# EAGLE board KAC12040_sfe_v0.3 (EAGLE 6.5.2)
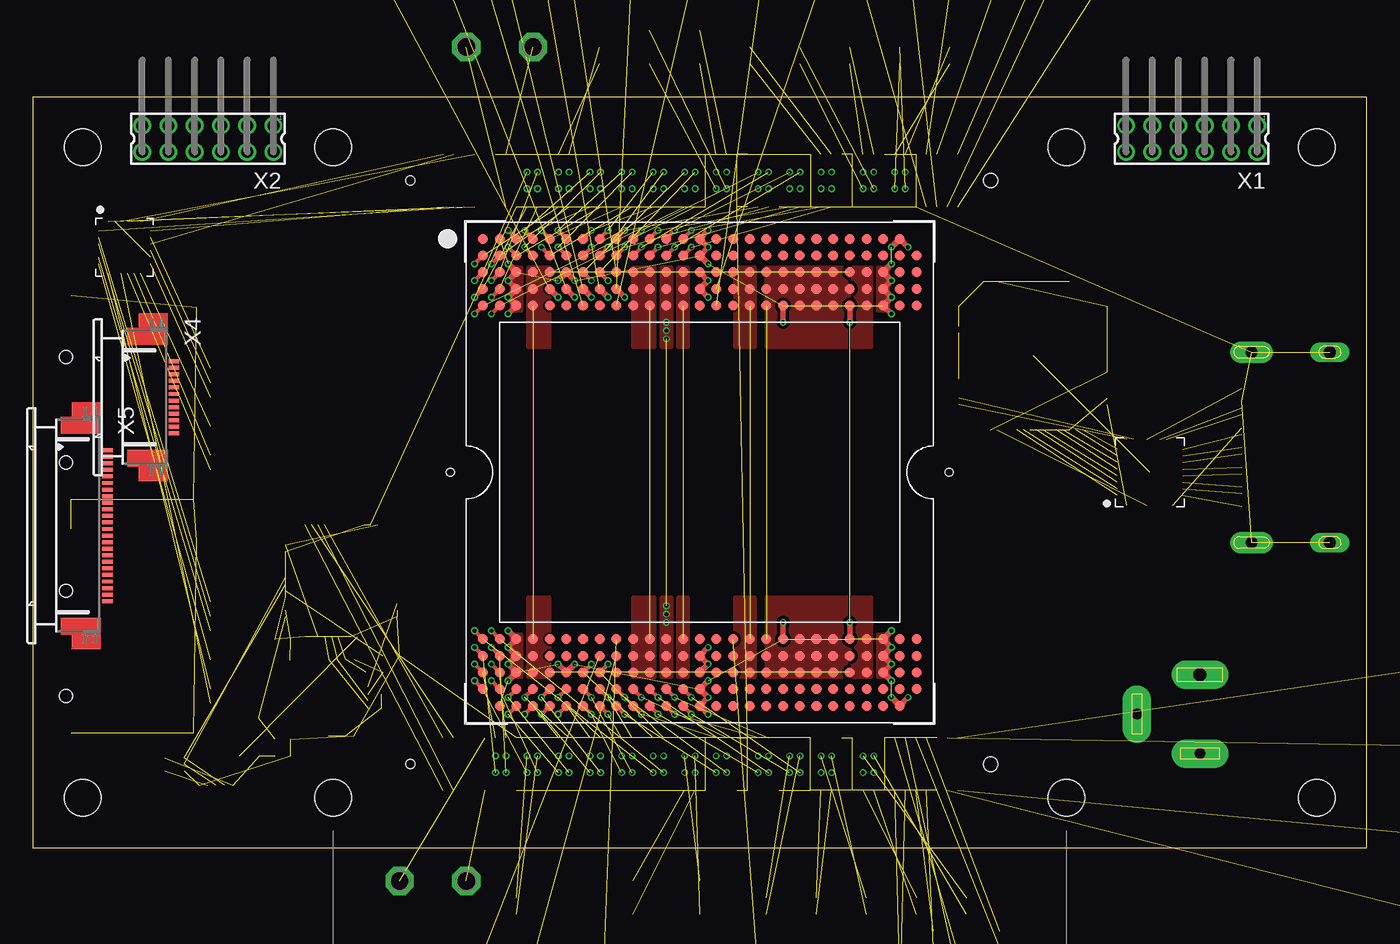
[diagram p6: board, top side]
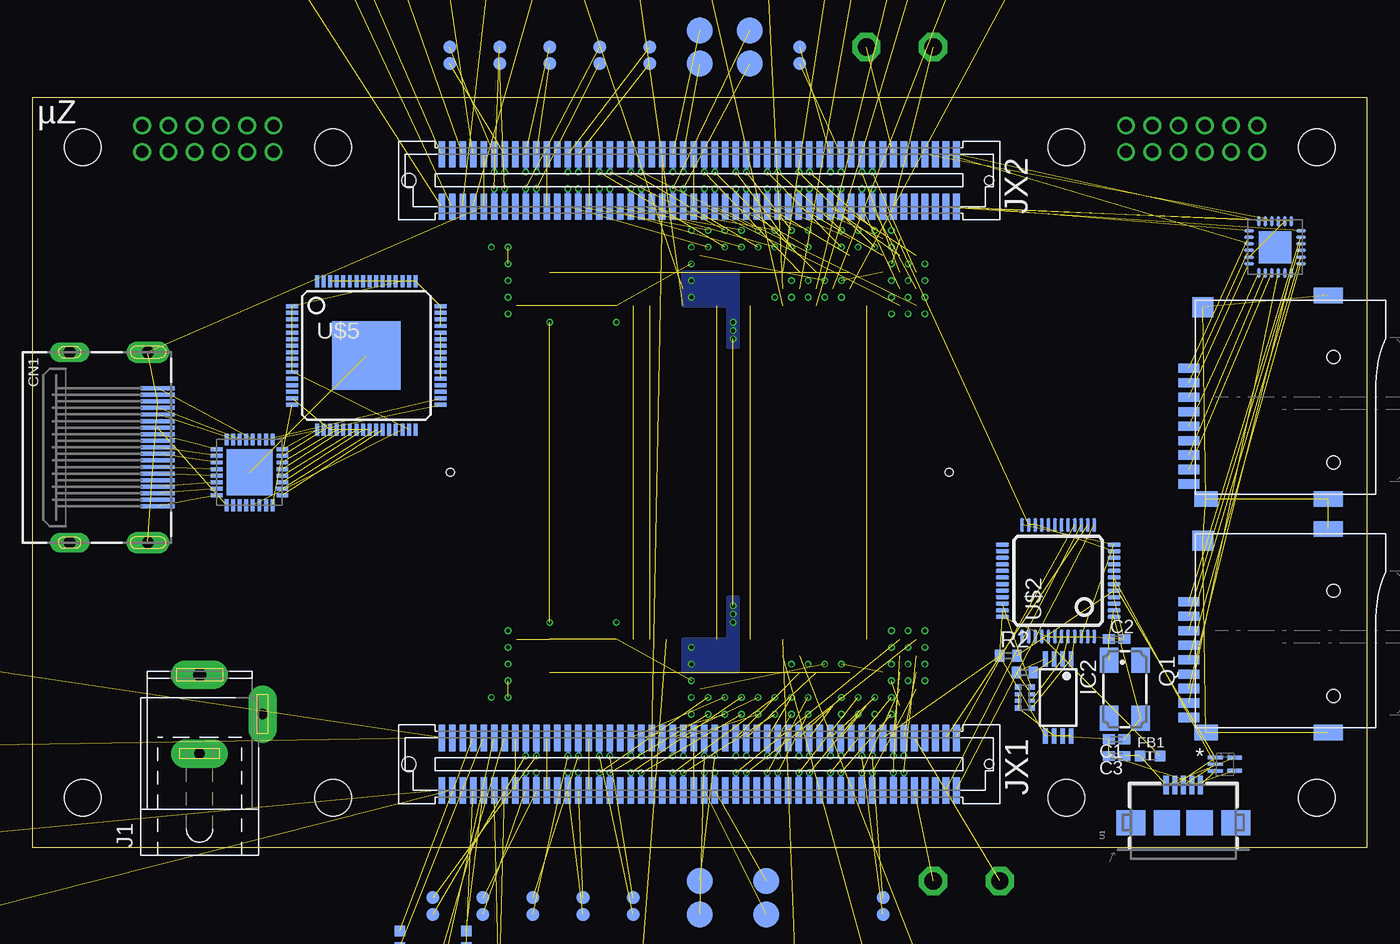
[diagram p7: board, bottom side, seen from below]

Size 101.6 x 57.15 mm. Coordinates in mm from the lower left corner, seen from the top.
Outline: 0,0 101.6,0 101.6,57.15 0,57.15 0,0
Copper layers (1+2*15+16): Top 0.035559375mm / dielectric 0.17018125mm / Route2 0.01778125mm / dielectric 47mil / Route15 0.0356mm / dielectric 0.2007mm / Bottom 0.0356mm
Design rules "LaenPCBOrder4L *": minimum track width 5mil, minimum drill 10mil, track to track 5mil, track to pad 5mil, pad to pad 5mil, via to via 5mil, smd to smd 5mil, copper to edge 15mil, drill to drill 5mil, minimum pad ring 4mil, minimum via ring 4mil, stop-mask expansion 4mil, vias tented up to drill 15mil, thermal gap 8mil
Net classes: 1 LVDS: width 0.305 mm, drill 0.305 mm, clearance 0.152 mm
Holes 2.8 mm at 22.86,3.81 78.74,3.81 78.74,53.34 22.86,53.34
tKeepout: area 1.3,1.3 to 6.3,6.3; area 1.3,50.8 to 6.3,55.8; area 95.3,50.8 to 100.3,55.8; area 95.3,1.3 to 100.3,6.3
bKeepout: area 20.4,1.3 to 25.4,6.3; area 20.4,50.8 to 25.4,55.8; area 76.2,50.8 to 81.2,55.8; area 76.2,1.3 to 81.2,6.3

## Footprints (pad centres in the part's own frame; a part is rotated, then mirrored left to right if it is on the bottom)
C0402K = smd 0.925 x 0.74: 1 -0.6,0; 2 0.6,0
HDMI_MOLEX_47151-0001 = smd 0.3 x 2.6: 1 4.5,0; 2 4,0; 3 3.5,0; 4 3,0; 5 2.5,0; 6 2,0; 7 1.5,0; 8 1,0; 9 0.5,0; 10 0,0; 11 -0.5,0; 12 -1,0; 13 -1.5,0; 14 -2,0; 15 -2.5,0; 16 -3,0; 17 -3.5,0; 18 -4,0; 19 -4.5,0 | drill 0.9 pad 1.65 long: P$1 -7.25,-0.76; P$2 7.25,-0.76 | drill 0.9 pad 1.5 long: P$3 7.25,-6.72; P$4 -7.25,-6.72
_0603MP = smd 0.8 x 0.8: 1 -0.762,0; 2 0.762,0
TSSOP8 = smd 0.35 x 1.2: 1 -0.975,-2.925; 2 -0.325,-2.925; 3 0.325,-2.925; 4 0.975,-2.925; 5 0.975,2.925; 6 0.325,2.925; 7 -0.325,2.925; 8 -0.975,2.925
SPC4077 = drill 0.8 pad 2.184 long: 1 -3,0; 2 0,-4.8 | drill 1 pad 2.184 long: 3 3,0
CTS406 = smd 1.9 x 1.4: 1 -2.2,-1.2; 2 2.2,-1.2; 3 2.2,1.2; 4 -2.2,1.2
R0402 = smd 0.7 x 0.9: 1 -0.65,0; 2 0.65,0
4X0402ARV341 = smd 0.4 x 0.5: 1 -0.8,-0.5; 4 0.8,-0.5; 5 0.8,0.5; 8 -0.8,0.5 | smd 0.3 x 0.5: 2 -0.25,-0.5; 3 0.25,-0.5; 6 0.25,0.5; 7 -0.25,0.5
TP10R = smd 1 x 1: TP 0,0
TP20R = smd 2 x 2: TP 0,0
P1-13 = drill 1.321 pad 2.159 octagon: TP 0,0
TP08SQ = smd 0.8 x 0.8: TP 0,0
TP18SQ = smd 1.8 x 1.8: TP 0,0
P1-13Y = drill 1.321 pad 1.905 long: TP 0,0
TP15SQ = smd 1.5 x 1.5: TP 0,0
TP15R = smd 1.5 x 1.5: TP 0,0
USB-AB-MICRO-SMD = smd 1.4 x 0.4: D+ 2.85,0; D- 2.85,0.65; GND 2.85,-1.3; ID 2.85,-0.65; VBUS 2.85,1.3 | smd 1.9 x 2: P$6 0,1.25; P$7 0,-1.25 | smd 1.9 x 2.2: P$8 0,4; P$9 0,-4
SOT50P160X60-5N = smd 1.118 x 0.254: 1 -0.737,0.508; 2 -0.737,0; 3 -0.737,-0.508 | smd 1.118 x 0.305: 4 0.737,-0.508; 5 0.737,0.508
KAC-12040-RB501T4 = smd 0.76 x 0.76: A01 -16.51,17.78; A02 -15.24,17.78; A03 -13.97,17.78; A04 -12.7,17.78; A05 -11.43,17.78; A06 -10.16,17.78; A07 -8.89,17.78; A08 -7.62,17.78; A09 -6.35,17.78; A10 -5.08,17.78; A11 -3.81,17.78; A12 -2.54,17.78; A13 -1.27,17.78; A14 0,17.78; A15 1.27,17.78; A16 2.54,17.78; A17 3.81,17.78; A18 5.08,17.78; A19 6.35,17.78; A20 7.62,17.78; A21 8.89,17.78; A22 10.16,17.78; A23 11.43,17.78; A24 12.7,17.78; A25 13.97,17.78; A26 15.24,17.78; AA01 -16.51,-12.7; AA02 -15.24,-12.7; AA03 -13.97,-12.7; AA04 -12.7,-12.7; AA05 -11.43,-12.7; AA06 -10.16,-12.7; AA07 -8.89,-12.7; AA08 -7.62,-12.7; AA09 -6.35,-12.7; AA10 -5.08,-12.7; AA11 -3.81,-12.7; AA12 -2.54,-12.7; AA13 -1.27,-12.7; AA14 0,-12.7; AA15 1.27,-12.7; AA16 2.54,-12.7; AA17 3.81,-12.7; AA18 5.08,-12.7; AA19 6.35,-12.7; AA20 7.62,-12.7; AA21 8.89,-12.7; AA22 10.16,-12.7; AA23 11.43,-12.7; AA24 12.7,-12.7; AA25 13.97,-12.7; AA26 15.24,-12.7; AA27 16.51,-12.7; AB01 -16.51,-13.97; AB02 -15.24,-13.97; AB03 -13.97,-13.97; AB04 -12.7,-13.97; AB05 -11.43,-13.97; AB06 -10.16,-13.97; AB07 -8.89,-13.97; AB08 -7.62,-13.97; AB09 -6.35,-13.97; AB10 -5.08,-13.97; AB11 -3.81,-13.97; AB12 -2.54,-13.97; AB13 -1.27,-13.97; AB14 0,-13.97; AB15 1.27,-13.97; AB16 2.54,-13.97; AB17 3.81,-13.97; AB18 5.08,-13.97; AB19 6.35,-13.97; AB20 7.62,-13.97; AB21 8.89,-13.97; AB22 10.16,-13.97; AB23 11.43,-13.97; AB24 12.7,-13.97; AB25 13.97,-13.97; AB26 15.24,-13.97; AB27 16.51,-13.97; AC01 -16.51,-15.24; AC02 -15.24,-15.24; AC03 -13.97,-15.24; AC04 -12.7,-15.24; AC05 -11.43,-15.24; AC06 -10.16,-15.24; AC07 -8.89,-15.24; AC08 -7.62,-15.24; AC09 -6.35,-15.24; AC10 -5.08,-15.24; AC11 -3.81,-15.24; AC12 -2.54,-15.24; AC13 -1.27,-15.24; AC14 0,-15.24; AC15 1.27,-15.24; AC16 2.54,-15.24; AC17 3.81,-15.24; AC18 5.08,-15.24; AC19 6.35,-15.24; AC20 7.62,-15.24; AC21 8.89,-15.24; AC22 10.16,-15.24; AC23 11.43,-15.24; AC24 12.7,-15.24; AC25 13.97,-15.24; AC26 15.24,-15.24; AC27 16.51,-15.24; AD01 -16.51,-16.51; AD02 -15.24,-16.51; AD03 -13.97,-16.51; AD04 -12.7,-16.51; AD05 -11.43,-16.51; AD06 -10.16,-16.51; AD07 -8.89,-16.51; AD08 -7.62,-16.51; AD09 -6.35,-16.51; AD10 -5.08,-16.51; AD11 -3.81,-16.51; AD12 -2.54,-16.51; AD13 -1.27,-16.51; AD14 0,-16.51; AD15 1.27,-16.51; AD16 2.54,-16.51; AD17 3.81,-16.51; AD18 5.08,-16.51; AD19 6.35,-16.51; AD20 7.62,-16.51; AD21 8.89,-16.51; AD22 10.16,-16.51; AD23 11.43,-16.51; AD24 12.7,-16.51; AD25 13.97,-16.51; AD26 15.24,-16.51; AD27 16.51,-16.51; AE02 -15.24,-17.78; AE03 -13.97,-17.78; AE04 -12.7,-17.78; AE05 -11.43,-17.78; AE06 -10.16,-17.78; AE07 -8.89,-17.78; AE08 -7.62,-17.78; AE09 -6.35,-17.78; AE10 -5.08,-17.78; AE11 -3.81,-17.78; AE12 -2.54,-17.78; AE13 -1.27,-17.78; AE14 0,-17.78; AE15 1.27,-17.78; AE16 2.54,-17.78; AE17 3.81,-17.78; AE18 5.08,-17.78; AE19 6.35,-17.78; AE20 7.62,-17.78; AE21 8.89,-17.78; AE22 10.16,-17.78; AE23 11.43,-17.78; AE24 12.7,-17.78; AE25 13.97,-17.78; AE26 15.24,-17.78; B01 -16.51,16.51; B02 -15.24,16.51; B03 -13.97,16.51; B04 -12.7,16.51; B05 -11.43,16.51; B06 -10.16,16.51; B07 -8.89,16.51; B08 -7.62,16.51; B09 -6.35,16.51; B10 -5.08,16.51; B11 -3.81,16.51; B12 -2.54,16.51; B13 -1.27,16.51; B14 0,16.51; B15 1.27,16.51; B16 2.54,16.51; B17 3.81,16.51; B18 5.08,16.51; B19 6.35,16.51; B20 7.62,16.51; B21 8.89,16.51; B22 10.16,16.51; B23 11.43,16.51; B24 12.7,16.51; B25 13.97,16.51; B26 15.24,16.51; B27 16.51,16.51; C01 -16.51,15.24; C02 -15.24,15.24; C03 -13.97,15.24; C04 -12.7,15.24; C05 -11.43,15.24; C06 -10.16,15.24; C07 -8.89,15.24; C08 -7.62,15.24; C09 -6.35,15.24; C10 -5.08,15.24; C11 -3.81,15.24; C12 -2.54,15.24; C13 -1.27,15.24; C14 0,15.24; C15 1.27,15.24; C16 2.54,15.24; C17 3.81,15.24; C18 5.08,15.24; C19 6.35,15.24; C20 7.62,15.24; C21 8.89,15.24; C22 10.16,15.24; C23 11.43,15.24; C24 12.7,15.24; C25 13.97,15.24; C26 15.24,15.24; C27 16.51,15.24; D01 -16.51,13.97; D02 -15.24,13.97; D03 -13.97,13.97; D04 -12.7,13.97; D05 -11.43,13.97; D06 -10.16,13.97; D07 -8.89,13.97; D08 -7.62,13.97; D09 -6.35,13.97; D10 -5.08,13.97; D11 -3.81,13.97; D12 -2.54,13.97; D13 -1.27,13.97; D14 0,13.97; D15 1.27,13.97; D16 2.54,13.97; D17 3.81,13.97; D18 5.08,13.97; D19 6.35,13.97; D20 7.62,13.97; D21 8.89,13.97; D22 10.16,13.97; D23 11.43,13.97; D24 12.7,13.97; D25 13.97,13.97; D26 15.24,13.97; D27 16.51,13.97; E01 -16.51,12.7; E02 -15.24,12.7; E03 -13.97,12.7; E04 -12.7,12.7; E05 -11.43,12.7; E06 -10.16,12.7; E07 -8.89,12.7; E08 -7.62,12.7; E09 -6.35,12.7; E10 -5.08,12.7; E11 -3.81,12.7; E12 -2.54,12.7; E13 -1.27,12.7; E14 0,12.7; E15 1.27,12.7; E16 2.54,12.7; E17 3.81,12.7; E18 5.08,12.7; E19 6.35,12.7; E20 7.62,12.7; E21 8.89,12.7; E22 10.16,12.7; E23 11.43,12.7; E24 12.7,12.7; E25 13.97,12.7; E26 15.24,12.7; E27 16.51,12.7 | hole 0.6: -19,0; 19,0; -19,0; 19,0
LQFP48 = smd 0.3 x 1: 1 -2.75,-4.25; 2 -2.25,-4.25; 3 -1.75,-4.25; 4 -1.25,-4.25; 5 -0.75,-4.25; 6 -0.25,-4.25; 7 0.25,-4.25; 8 0.75,-4.25; 9 1.25,-4.25; 10 1.75,-4.25; 11 2.25,-4.25; 12 2.75,-4.25; 25 2.75,4.25; 26 2.25,4.25; 27 1.75,4.25; 28 1.25,4.25; 29 0.75,4.25; 30 0.25,4.25; 31 -0.25,4.25; 32 -0.75,4.25; 33 -1.25,4.25; 34 -1.75,4.25; 35 -2.25,4.25; 36 -2.75,4.25 | smd 1 x 0.3: 13 4.25,-2.75; 14 4.25,-2.25; 15 4.25,-1.75; 16 4.25,-1.25; 17 4.25,-0.75; 18 4.25,-0.25; 19 4.25,0.25; 20 4.25,0.75; 21 4.25,1.25; 22 4.25,1.75; 23 4.25,2.25; 24 4.25,2.75; 37 -4.25,2.75; 38 -4.25,2.25; 39 -4.25,1.75; 40 -4.25,1.25; 41 -4.25,0.75; 42 -4.25,0.25; 43 -4.25,-0.25; 44 -4.25,-0.75; 45 -4.25,-1.25; 46 -4.25,-1.75; 47 -4.25,-2.25; 48 -4.25,-2.75
SOT617-3 = smd 0.9 x 0.3: 1 -2.5,1.75; 2 -2.5,1.25; 3 -2.5,0.75; 4 -2.5,0.25; 5 -2.5,-0.25; 6 -2.5,-0.75; 7 -2.5,-1.25; 8 -2.5,-1.75; 17 2.5,-1.75; 18 2.5,-1.25; 19 2.5,-0.75; 20 2.5,-0.25; 21 2.5,0.25; 22 2.5,0.75; 23 2.5,1.25; 24 2.5,1.75 | smd 0.3 x 0.9: 9 -1.75,-2.5; 10 -1.25,-2.5; 11 -0.75,-2.5; 12 -0.25,-2.5; 13 0.25,-2.5; 14 0.75,-2.5; 15 1.25,-2.5; 16 1.75,-2.5; 25 1.75,2.5; 26 1.25,2.5; 27 0.75,2.5; 28 0.25,2.5; 29 -0.25,2.5; 30 -0.75,2.5; 31 -1.25,2.5; 32 -1.75,2.5 | smd 3.5 x 3.5: EPAD 0,0
S-PWQFN-N24 = smd 0.78 x 0.28: 1 -1.975,1.25; 2 -1.975,0.75; 3 -1.975,0.25; 4 -1.975,-0.25; 5 -1.975,-0.75; 6 -1.975,-1.25; 13 1.975,-1.25; 14 1.975,-0.75; 15 1.975,-0.25; 16 1.975,0.25; 17 1.975,0.75; 18 1.975,1.25 | smd 0.28 x 0.78: 7 -1.25,-1.975; 8 -0.75,-1.975; 9 -0.25,-1.975; 10 0.25,-1.975; 11 0.75,-1.975; 12 1.25,-1.975; 19 1.25,1.975; 20 0.75,1.975; 21 0.25,1.975; 22 -0.25,1.975; 23 -0.75,1.975; 24 -1.25,1.975 | smd 2.45 x 2.45: EPAD 0,0
LQFP-ST-64-2 = smd 0.9 x 0.3: 1 -5.65,3.75; 2 -5.65,3.25; 3 -5.65,2.75; 4 -5.65,2.25; 5 -5.65,1.75; 6 -5.65,1.25; 7 -5.65,0.75; 8 -5.65,0.25; 9 -5.65,-0.25; 10 -5.65,-0.75; 11 -5.65,-1.25; 12 -5.65,-1.75; 13 -5.65,-2.25; 14 -5.65,-2.75; 15 -5.65,-3.25; 16 -5.65,-3.75; 33 5.65,-3.75; 34 5.65,-3.25; 35 5.65,-2.75; 36 5.65,-2.25; 37 5.65,-1.75; 38 5.65,-1.25; 39 5.65,-0.75; 40 5.65,-0.25; 41 5.65,0.25; 42 5.65,0.75; 43 5.65,1.25; 44 5.65,1.75; 45 5.65,2.25; 46 5.65,2.75; 47 5.65,3.25; 48 5.65,3.75 | smd 0.3 x 0.9: 17 -3.75,-5.65; 18 -3.25,-5.65; 19 -2.75,-5.65; 20 -2.25,-5.65; 21 -1.75,-5.65; 22 -1.25,-5.65; 23 -0.75,-5.65; 24 -0.25,-5.65; 25 0.25,-5.65; 26 0.75,-5.65; 27 1.25,-5.65; 28 1.75,-5.65; 29 2.25,-5.65; 30 2.75,-5.65; 31 3.25,-5.65; 32 3.75,-5.65; 49 3.75,5.65; 50 3.25,5.65; 51 2.75,5.65; 52 2.25,5.65; 53 1.75,5.65; 54 1.25,5.65; 55 0.75,5.65; 56 0.25,5.65; 57 -0.25,5.65; 58 -0.75,5.65; 59 -1.25,5.65; 60 -1.75,5.65; 61 -2.25,5.65; 62 -2.75,5.65; 63 -3.25,5.65; 64 -3.75,5.65 | smd 5.2 x 5.2: EPAD 0,0
332-12 = drill 0.9 pad 1.27: 1 -5,-1; 2 -5,1; 3 -3,-1; 4 -3,1; 5 -1,-1; 6 -1,1; 7 1,-1; 8 1,1; 9 3,-1; 10 3,1; 11 5,-1; 12 5,1
52745-1690 = smd 0.3 x 0.8: 1 -3.75,2.5; 2 -3.25,2.5; 3 -2.75,2.5; 4 -2.25,2.5; 5 -1.75,2.5; 6 -1.25,2.5; 7 -0.75,2.5; 8 -0.25,2.5; 9 0.25,2.5; 10 0.75,2.5; 11 1.25,2.5; 12 1.75,2.5; 13 2.25,2.5; 14 2.75,2.5; 15 3.25,2.5; 16 3.75,2.5
52745-1290 = smd 0.3 x 0.8: 1 -2.75,2.5; 2 -2.25,2.5; 3 -1.75,2.5; 4 -1.25,2.5; 5 -0.75,2.5; 6 -0.25,2.5; 7 0.25,2.5; 8 0.75,2.5; 9 1.25,2.5; 10 1.75,2.5; 11 2.25,2.5; 12 2.75,2.5
52745-2490 = smd 0.3 x 0.8: 1 -5.75,2.5; 2 -5.25,2.5; 3 -4.75,2.5; 4 -4.25,2.5; 5 -3.75,2.5; 6 -3.25,2.5; 7 -2.75,2.5; 8 -2.25,2.5; 9 -1.75,2.5; 10 -1.25,2.5; 11 -0.75,2.5; 12 -0.25,2.5; 13 0.25,2.5; 14 0.75,2.5; 15 1.25,2.5; 16 1.75,2.5; 17 2.25,2.5; 18 2.75,2.5; 19 3.25,2.5; 20 3.75,2.5; 21 4.25,2.5; 22 4.75,2.5; 23 5.25,2.5; 24 5.75,2.5
µZ = smd 0.5 x 2: 1 70.351,4.349; 2 70.351,8.349; 3 69.551,4.349; 4 69.551,8.349; 5 68.751,4.349; 6 68.751,8.349; 7 67.951,4.349; 8 67.951,8.349; 9 67.151,4.349; 10 67.151,8.349; 11 66.351,4.349; 12 66.351,8.349; 13 65.551,4.349; 14 65.551,8.349; 15 64.751,4.349; 16 64.751,8.349; 17 63.951,4.349; 18 63.951,8.349; 19 63.151,4.349; 20 63.151,8.349; 21 62.351,4.349; 22 62.351,8.349; 23 61.551,4.349; 24 61.551,8.349; 25 60.751,4.349; 26 60.751,8.349; 27 59.951,4.349; 28 59.951,8.349; 29 59.151,4.349; 30 59.151,8.349; 31 58.351,4.349; 32 58.351,8.349; 33 57.551,4.349; 34 57.551,8.349; 35 56.751,4.349; 36 56.751,8.349; 37 55.951,4.349; 38 55.951,8.349; 39 55.151,4.349; 40 55.151,8.349; 41 54.351,4.349; 42 54.351,8.349; 43 53.551,4.349; 44 53.551,8.349; 45 52.751,4.349; 46 52.751,8.349; 47 51.951,4.349; 48 51.951,8.349; 49 51.151,4.349; 50 51.151,8.349; 51 50.351,4.349; 52 50.351,8.349; 53 49.551,4.349; 54 49.551,8.349; 55 48.751,4.349; 56 48.751,8.349; 57 47.951,4.349; 58 47.951,8.349; 59 47.151,4.349; 60 47.151,8.349; 61 46.351,4.349; 62 46.351,8.349; 63 45.551,4.349; 64 45.551,8.349; 65 44.751,4.349; 66 44.751,8.349; 67 43.951,4.349; 68 43.951,8.349; 69 43.151,4.349; 70 43.151,8.349; 71 42.351,4.349; 72 42.351,8.349; 73 41.551,4.349; 74 41.551,8.349; 75 40.751,4.349; 76 40.751,8.349; 77 39.951,4.349; 78 39.951,8.349; 79 39.151,4.349; 80 39.151,8.349; 81 38.351,4.349; 82 38.351,8.349; 83 37.551,4.349; 84 37.551,8.349; 85 36.751,4.349; 86 36.751,8.349; 87 35.951,4.349; 88 35.951,8.349; 89 35.151,4.349; 90 35.151,8.349; 91 34.351,4.349; 92 34.351,8.349; 93 33.551,4.349; 94 33.551,8.349; 95 32.751,4.349; 96 32.751,8.349; 97 31.951,4.349; 98 31.951,8.349; 99 31.151,4.349; 100 31.151,8.349; 101 70.351,48.801; 102 70.351,52.801; 103 69.551,48.801; 104 69.551,52.801; 105 68.751,48.801; 106 68.751,52.801; 107 67.951,48.801; 108 67.951,52.801; 109 67.151,48.801; 110 67.151,52.801; 111 66.351,48.801; 112 66.351,52.801; 113 65.551,48.801; 114 65.551,52.801; 115 64.751,48.801; 116 64.751,52.801; 117 63.951,48.801; 118 63.951,52.801; 119 63.151,48.801; 120 63.151,52.801; 121 62.351,48.801; 122 62.351,52.801; 123 61.551,48.801; 124 61.551,52.801; 125 60.751,48.801; 126 60.751,52.801; 127 59.951,48.801; 128 59.951,52.801; 129 59.151,48.801; 130 59.151,52.801; 131 58.351,48.801; 132 58.351,52.801; 133 57.551,48.801; 134 57.551,52.801; 135 56.751,48.801; 136 56.751,52.801; 137 55.951,48.801; 138 55.951,52.801; 139 55.151,48.801; 140 55.151,52.801; 141 54.351,48.801; 142 54.351,52.801; 143 53.551,48.801; 144 53.551,52.801; 145 52.751,48.801; 146 52.751,52.801; 147 51.951,48.801; 148 51.951,52.801; 149 51.151,48.801; 150 51.151,52.801; 151 50.351,48.801; 152 50.351,52.801; 153 49.551,48.801; 154 49.551,52.801; 155 48.751,48.801; 156 48.751,52.801; 157 47.951,48.801; 158 47.951,52.801; 159 47.151,48.801; 160 47.151,52.801; 161 46.351,48.801; 162 46.351,52.801; 163 45.551,48.801; 164 45.551,52.801; 165 44.751,48.801; 166 44.751,52.801; 167 43.951,48.801; 168 43.951,52.801; 169 43.151,48.801; 170 43.151,52.801; 171 42.351,48.801; 172 42.351,52.801; 173 41.551,48.801; 174 41.551,52.801; 175 40.751,48.801; 176 40.751,52.801; 177 39.951,48.801; 178 39.951,52.801; 179 39.151,48.801; 180 39.151,52.801; 181 38.351,48.801; 182 38.351,52.801; 183 37.551,48.801; 184 37.551,52.801; 185 36.751,48.801; 186 36.751,52.801; 187 35.951,48.801; 188 35.951,52.801; 189 35.151,48.801; 190 35.151,52.801; 191 34.351,48.801; 192 34.351,52.801; 193 33.551,48.801; 194 33.551,52.801; 195 32.751,48.801; 196 32.751,52.801; 197 31.951,48.801; 198 31.951,52.801; 199 31.151,48.801; 200 31.151,52.801 | hole 2.8: 3.81,3.81; 3.81,53.34; 97.79,3.81; 97.79,53.34 | hole 1.1: 28.651,6.349; 28.651,50.801 | hole 0.7: 72.851,6.349; 72.851,50.801
TF-MICRO-SD_PP3 = smd 0.7 x 1.6: 1 2.2,11; 2 1.1,11; 3 0,11; 4 -1.1,11; 5 -2.2,11; 6 -3.3,11; 7 -4.4,11; 8 -5.5,11; CD -6.6,11 | smd 1.2 x 2.2: MT1 -7.75,0.4; MT2 7.75,0.4 | smd 1.2 x 1.8: MT3 -7.75,9.7 | smd 1.5 x 1.6: MT4 6.85,9.95 | hole 1: -4.95,0; 3.05,0

## Placement (x,y rotation side)
C1  [C0402K]  19.05,8.26 180 bottom
C2  [C0402K]  19.05,15.88 0 bottom
C3  100n  [C0402K]  19.05,6.99 180 bottom
CN1  [HDMI_MOLEX_47151-0001]  92.08,30.48 270 bottom
FB1  600R  [_0603MP]  16.51,6.99 0 bottom
IC2  93LC46ST  [TSSOP8]  23.5,11.43 180 bottom
J1  [SPC4077]  88.9,10.16 90 bottom
Q1  [CTS406]  18.41,12.06 270 bottom
R1  2k  [R0402]  26.04,13.34 0 bottom
R2  12k  [R0402]  27.3,14.61 0 bottom
RN1  [4X0402ARV341]  26.04,11.43 90 bottom
TP1  TPTP10R  [TP10R]  36.83,-3.81 0 bottom  (outside the outline)
TP2  TPTP20R  [TP20R]  45.72,-2.54 90 bottom
TP3  TPTP20R  [TP20R]  50.8,-2.54 90 bottom
TP4  TPTP10R  [TP10R]  55.88,-3.81 90 bottom  (outside the outline)
TP5  TPTP10R  [TP10R]  59.69,-3.81 90 bottom  (outside the outline)
TP6  TPTP10R  [TP10R]  63.5,-3.81 90 bottom  (outside the outline)
TP7  TPTP10R  [TP10R]  67.31,-3.81 90 bottom  (outside the outline)
TP8  TPTP10R  [TP10R]  71.12,-3.81 90 bottom  (outside the outline)
TP9  TPTP10R  [TP10R]  43.18,59.69 90 bottom
TP10  TPTP20R  [TP20R]  46.99,59.69 90 bottom
TP11  TPTP20R  [TP20R]  50.8,59.69 90 bottom
TP12  TPTP10R  [TP10R]  54.61,59.69 90 bottom
TP13  TPTP10R  [TP10R]  58.42,59.69 90 bottom
TP14  TPTP10R  [TP10R]  62.23,59.69 90 bottom
TP15  TPTP10R  [TP10R]  66.04,59.69 90 bottom
TP16  TPTP10R  [TP10R]  69.85,59.69 90 bottom
TP17  TPPAD1-13  [P1-13]  33.02,-2.54 270 top
TP18  TPPAD1-13  [P1-13]  27.94,-2.54 270 top
TP19  TPPAD1-13  [P1-13]  33.02,60.96 90 top  (outside the outline)
TP20  TPPAD1-13  [P1-13]  38.1,60.96 90 top  (outside the outline)
TP21  TPTP08SQ  [TP08SQ]  68.58,-6.35 90 bottom  (outside the outline)
TP22  TPTP08SQ  [TP08SQ]  68.58,-7.62 90 bottom  (outside the outline)
TP23  TPTP08SQ  [TP08SQ]  73.66,-7.62 90 bottom  (outside the outline)
TP24  TPTP08SQ  [TP08SQ]  73.66,-6.35 90 bottom  (outside the outline)
TP25  TPTP08SQ  [TP08SQ]  60.96,73.66 90 bottom  (outside the outline)
TP26  TPTP08SQ  [TP08SQ]  66.04,73.66 90 bottom  (outside the outline)
TP27  TPTP08SQ  [TP08SQ]  71.12,73.66 90 bottom  (outside the outline)
TP28  TPTP08SQ  [TP08SQ]  76.2,73.66 90 bottom  (outside the outline)
TP29  TPTP08SQ  [TP08SQ]  81.28,73.66 90 bottom  (outside the outline)
TP30  TPTP08SQ  [TP08SQ]  86.36,73.66 90 bottom  (outside the outline)
TP31  TPPAD1-13  [P1-13]  76.2,66.04 0 top  (outside the outline)
TP32  TPTP18SQ  [TP18SQ]  66.04,-10.16 90 bottom  (outside the outline)
TP33  TPTP18SQ  [TP18SQ]  66.04,-12.7 90 bottom  (outside the outline)
TP34  TPTP18SQ  [TP18SQ]  71.12,-10.16 90 bottom  (outside the outline)
TP35  TPTP18SQ  [TP18SQ]  71.12,-12.7 90 bottom  (outside the outline)
TP36  TPPAD1-13Y  [P1-13Y]  116.84,-7.62 180 top  (outside the outline)
TP37  TPPAD1-13Y  [P1-13Y]  116.84,0 180 top  (outside the outline)
TP38  TPPAD1-13Y  [P1-13Y]  116.84,7.62 180 top  (outside the outline)
TP39  TPPAD1-13Y  [P1-13Y]  116.84,15.24 180 top  (outside the outline)
TP40  TPTP10R  [TP10R]  36.83,-5.08 90 bottom  (outside the outline)
TP41  TPTP20R  [TP20R]  45.72,-5.08 90 bottom  (outside the outline)
TP42  TPTP20R  [TP20R]  50.8,-5.08 90 bottom  (outside the outline)
TP43  TPTP10R  [TP10R]  55.88,-5.08 90 bottom  (outside the outline)
TP44  TPTP10R  [TP10R]  59.69,-5.08 90 bottom  (outside the outline)
TP45  TPTP10R  [TP10R]  63.5,-5.08 90 bottom  (outside the outline)
TP46  TPTP10R  [TP10R]  67.31,-5.08 90 bottom  (outside the outline)
TP47  TPTP10R  [TP10R]  71.12,-5.08 90 bottom  (outside the outline)
TP48  TPTP10R  [TP10R]  43.18,60.96 90 bottom  (outside the outline)
TP49  TPTP20R  [TP20R]  46.99,62.23 90 bottom  (outside the outline)
TP50  TPTP20R  [TP20R]  50.8,62.23 90 bottom  (outside the outline)
TP51  TPTP10R  [TP10R]  54.61,60.96 90 bottom  (outside the outline)
TP52  TPTP10R  [TP10R]  58.42,60.96 90 bottom  (outside the outline)
TP53  TPTP10R  [TP10R]  62.23,60.96 90 bottom  (outside the outline)
TP54  TPTP10R  [TP10R]  66.04,60.96 90 bottom  (outside the outline)
TP55  TPTP10R  [TP10R]  69.85,60.96 90 bottom  (outside the outline)
TP56  TPTP15SQ  [TP15SQ]  25.4,68.58 90 top  (outside the outline)
TP57  TPTP15SQ  [TP15SQ]  30.48,68.58 90 top  (outside the outline)
TP58  TPTP15SQ  [TP15SQ]  35.56,68.58 90 top  (outside the outline)
TP59  TPTP15SQ  [TP15SQ]  40.64,68.58 90 top  (outside the outline)
TP60  TPTP15SQ  [TP15SQ]  45.72,68.58 90 top  (outside the outline)
TP61  TPTP15SQ  [TP15SQ]  55.88,68.58 90 top  (outside the outline)
TP62  TPTP15SQ  [TP15SQ]  60.96,68.58 90 top  (outside the outline)
TP63  TPTP15SQ  [TP15SQ]  55.88,-17.78 0 top  (outside the outline)
TP64  TPTP15SQ  [TP15SQ]  43.18,-17.78 0 top  (outside the outline)
TP65  TPTP15SQ  [TP15SQ]  50.8,68.58 90 top  (outside the outline)
TP66  TPTP15R  [TP15R]  35.56,-17.78 0 top  (outside the outline)
TP67  TPTP15R  [TP15R]  33.02,71.12 0 top  (outside the outline)
TP68  TPTP15R  [TP15R]  38.1,71.12 0 top  (outside the outline)
TP69  TPTP15R  [TP15R]  30.48,-17.78 0 top  (outside the outline)
U1  [USB-AB-MICRO-SMD]  13.97,1.91 90 bottom
U2  TPD3E001DRLR  [SOT50P160X60-5N]  10.79,6.35 0 bottom
U$1  KAC-12040-RB501T4  [KAC-12040-RB501T4]  50.8,28.57 0 top
U$2  FT232H  [LQFP48]  23.5,20.32 90 bottom
U$3  IP4786CZ32SOT617-3  [SOT617-3]  85.09,28.57 180 bottom
U$4  TXS02612  [S-PWQFN-N24]  6.99,45.72 270 bottom
U$5  ADV7513  [LQFP-ST-64-2]  76.2,37.47 0 bottom
X1  332-12  [332-12]  88.27,53.98 180 top
X2  332-12  [332-12]  13.34,53.98 180 top
X3  52745-1690  [52745-1690]  129.54,48.26 90 top  (outside the outline)
X4  52745-1290  [52745-1290]  8.26,34.29 270 top
X5  52745-2490  [52745-2490]  3.17,24.51 270 top
ZED1  µZ-FCI_LVDS  [µZ]  101.6,0 0 bottom
µSD0  MICRO-SD3  [TF-MICRO-SD_PP3]  2.54,16.51 90 bottom
µSD1  MICRO-SD3  [TF-MICRO-SD_PP3]  2.54,34.29 90 bottom

## Tracks (layer width: path | path; a pad name or v marks a point on that pad's centre or on a via)
A_CLK  (1 unrouted)
A_CMD  (1 unrouted)
A_DAT0  (1 unrouted)
A_DAT1  (1 unrouted)
A_DAT2  (1 unrouted)
A_DAT3  (1 unrouted)
AVDD  (2 unrouted)
AVDD_HV  (1 unrouted)
  pour Top (no thermals): 45.72,38.1 45.72,44.2 47.37,44.2 47.37,38.1
  pour Top (no thermals): 45.72,12.95 45.72,19.05 47.37,19.05 47.37,12.95
AVDD_LV  (1 unrouted)
  pour Top (no thermals): 53.47,38.1 53.47,44.2 54.99,44.2 54.99,38.1
  pour Top (isolate 0.254, no thermals): 53.47,12.95 53.47,19.05 54.99,19.05 54.99,12.95
AVSS_HV  (via drill 0.3)  (1 unrouted)
  Top 0.406: v51.44,15.24 U$1.AB14 v51.44,13.97 U$1.AC14 | U$1.C14 v51.44,43.18 U$1.D14 v51.44,41.91
  other vias: 48.26,17.14 48.26,17.78 48.26,18.41 48.26,40.01 48.26,38.73 48.26,39.37
  pour Top (no thermals): 47.88,12.95 47.88,19.05 48.64,19.05 48.64,12.95
  pour Top (rank 2, no thermals): 47.88,38.1 47.88,44.2 48.64,44.2 48.64,38.1
  pour Bottom (no thermals): 47.88,13.34 47.88,19.05 48.64,19.05 48.64,15.88 52.07,15.88 52.07,13.34
  pour Bottom (no thermals): 47.88,43.81 47.88,38.1 48.64,38.1 48.64,41.27 52.07,41.27 52.07,43.81
B0_CLK  (1 unrouted)
B0_CMD  (1 unrouted)
B0_DAT0  (1 unrouted)
B0_DAT1  (1 unrouted)
B0_DAT2  (1 unrouted)
B0_DAT3  (1 unrouted)
B1_CLK  (1 unrouted)
B1_CMD  (1 unrouted)
B1_DAT0  (1 unrouted)
B1_DAT1  (1 unrouted)
B1_DAT2  (1 unrouted)
B1_DAT3  (1 unrouted)
C$0_N  (via drill 0.3)  (1 unrouted)
  Top 0.305: U$1.AA02 v34.92,16.51
  Bottom 0.305: ZED1.43 v48.05,5.71
C$0_P  (via drill 0.3, 0.33)  (1 unrouted)
  Top 0.305: U$1.AA01 v33.66,16.51
  Bottom 0.305: ZED1.41 v47.25,5.71
C$1_N  (via drill 0.3)  (1 unrouted)
  Top 0.305: U$1.E02 v34.92,40.64
  Bottom 0.305: ZED1.149 v50.45,50.16
C$1_P  (via drill 0.3)  (1 unrouted)
  Top 0.305: U$1.E01 v33.66,40.64
  Bottom 0.305: ZED1.147 v49.65,50.16
C$2_N  (via drill 0.3)  (1 unrouted)
  Top 0.305: U$1.AC08 v43.81,13.97
  Bottom 0.305: ZED1.44 v48.05,6.99
C$2_P  (via drill 0.3)  (1 unrouted)
  Top 0.305: U$1.AC07 v42.55,13.97
  Bottom 0.305: ZED1.42 v47.25,6.99
C$3_N  (via drill 0.3)  (1 unrouted)
  Top 0.305: U$1.C08 v43.81,43.18
  Bottom 0.305: ZED1.150 v50.45,51.44
C$3_P  (via drill 0.3)  (1 unrouted)
  Top 0.305: U$1.C07 v42.55,43.18
  Bottom 0.305: ZED1.148 v49.65,51.44
DVDD  (3 unrouted)
EE_CLK  (2 unrouted)
EE_CS  (2 unrouted)
EE_DATA  (2 unrouted)
EPAD  (1 unrouted)
GND  (68 unrouted)
L0$0_N  (via drill 0.3)  (1 unrouted)
  Top 0.305: U$1.AB02 v34.92,15.24
  Bottom 0.305: ZED1.13 v36.05,5.71
L0$0_P  (via drill 0.3)  (1 unrouted)
  Top 0.305: U$1.AB01 v33.66,15.24
  Bottom 0.305: ZED1.11 v35.25,5.71
L0$1_N  (via drill 0.3)  (1 unrouted)
  Top 0.305: U$1.D02 v34.92,41.91
  Bottom 0.305: ZED1.119 v38.45,50.16
L0$1_P  (via drill 0.3)  (1 unrouted)
  Top 0.305: U$1.D01 v33.66,41.91
  Bottom 0.305: ZED1.117 v37.65,50.16
L0$2_N  (via drill 0.3)  (1 unrouted)
  Top 0.305: U$1.AD07 v42.55,11.43
  Bottom 0.305: ZED1.37 v45.65,5.71
L0$2_P  (via drill 0.3)  (1 unrouted)
  Top 0.305: U$1.AE07 v42.55,10.16
  Bottom 0.305: ZED1.35 v44.85,5.71
L0$3_N  (via drill 0.3)  (1 unrouted)
  Top 0.305: U$1.B07 v42.55,45.72
  Bottom 0.305: ZED1.143 v48.05,50.16
L0$3_P  (via drill 0.3)  (1 unrouted)
  Top 0.305: U$1.A07 v42.55,46.99
  Bottom 0.305: ZED1.141 v47.25,50.16
L1$0_N  (via drill 0.3)  (1 unrouted)
  Top 0.305: U$1.AC02 v34.92,13.97
  Bottom 0.305: ZED1.14 v36.05,6.99
L1$0_P  (via drill 0.3)  (1 unrouted)
  Top 0.305: U$1.AC01 v33.66,13.97
  Bottom 0.305: ZED1.12 v35.25,6.99
L1$1_N  (via drill 0.3)  (1 unrouted)
  Top 0.305: U$1.C02 v34.92,43.18
  Bottom 0.305: ZED1.120 v38.45,51.44
L1$1_P  (via drill 0.3)  (1 unrouted)
  Top 0.305: U$1.C01 v33.66,43.18
  Bottom 0.305: ZED1.118 v37.65,51.44
L1$2_N  (via drill 0.3)  (1 unrouted)
  Top 0.305: U$1.AD08 v43.81,11.43
  Bottom 0.305: ZED1.38 v45.65,6.99
L1$2_P  (via drill 0.3)  (1 unrouted)
  Top 0.305: U$1.AE08 v43.81,10.16
  Bottom 0.305: ZED1.36 v44.85,6.99
L1$3_N  (via drill 0.3)  (1 unrouted)
  Top 0.305: U$1.B08 v43.81,45.72
  Bottom 0.305: ZED1.144 v48.05,51.44
L1$3_P  (via drill 0.3)  (1 unrouted)
  Top 0.305: U$1.A08 v43.81,46.99
  Bottom 0.305: ZED1.142 v47.25,51.44
L2$0_N  (via drill 0.3)  (1 unrouted)
  Top 0.305: U$1.AD02 v34.92,12.7
  Bottom 0.305: ZED1.19 v38.45,5.71
L2$0_P  (via drill 0.3)  (1 unrouted)
  Top 0.305: U$1.AD01 v33.66,12.7
  Bottom 0.305: ZED1.17 v37.65,5.71
L2$1_N  (via drill 0.3)  (1 unrouted)
  Top 0.305: U$1.B02 v34.92,44.45
  Bottom 0.305: ZED1.125 v40.85,50.16
L2$1_P  (via drill 0.3)  (1 unrouted)
  Top 0.305: U$1.B01 v33.66,44.45
  Bottom 0.305: ZED1.123 v40.05,50.16
L2$2_N  (via drill 0.3)  (1 unrouted)
  Top 0.305: U$1.AD09 v45.09,11.43
  Bottom 0.305: ZED1.55 v52.85,5.71
L2$2_P  (via drill 0.3)  (1 unrouted)
  Top 0.305: U$1.AE09 v45.09,10.16
  Bottom 0.305: ZED1.53 v52.05,5.71
L2$3_N  (via drill 0.3)  (1 unrouted)
  Top 0.305: U$1.B09 v45.09,45.72
  Bottom 0.305: ZED1.163 v56.05,50.16
L2$3_P  (via drill 0.3)  (1 unrouted)
  Top 0.305: U$1.A09 v45.09,46.99
  Bottom 0.305: ZED1.161 v55.25,50.16
L3$0_N  (via drill 0.3)  (1 unrouted)
  Top 0.305: U$1.AD03 v36.2,11.43
  Bottom 0.305: ZED1.25 v40.85,5.71
L3$0_P  (via drill 0.3)  (1 unrouted)
  Top 0.305: U$1.AE03 v36.2,10.16
  Bottom 0.305: ZED1.23 v40.05,5.71
L3$1_N  (via drill 0.3)  (1 unrouted)
  Top 0.305: U$1.B03 v36.2,45.72
  Bottom 0.305: ZED1.131 v43.25,50.16
L3$1_P  (via drill 0.3)  (1 unrouted)
  Top 0.305: U$1.A03 v36.2,46.99
  Bottom 0.305: ZED1.129 v42.45,50.16
L3$2_N  (via drill 0.3)  (1 unrouted)
  Top 0.305: U$1.AD10 v46.35,11.43
  Bottom 0.305: ZED1.56 v52.85,6.99
L3$2_P  (via drill 0.3)  (1 unrouted)
  Top 0.305: U$1.AE10 v46.35,10.16
  Bottom 0.305: ZED1.54 v52.05,6.99
L3$3_N  (via drill 0.3)  (1 unrouted)
  Top 0.305: U$1.B10 v46.35,45.72
  Bottom 0.305: ZED1.164 v56.05,51.44
L3$3_P  (via drill 0.3)  (1 unrouted)
  Top 0.305: U$1.A10 v46.35,46.99
  Bottom 0.305: ZED1.162 v55.25,51.44
L4$0_N  (via drill 0.3)  (1 unrouted)
  Top 0.305: U$1.AD04 v37.47,11.43
  Bottom 0.305: ZED1.26 v40.85,6.99
L4$0_P  (via drill 0.3)  (1 unrouted)
  Top 0.305: U$1.AE04 v37.47,10.16
  Bottom 0.305: ZED1.24 v40.05,6.99
L4$1_N  (via drill 0.3)  (1 unrouted)
  Top 0.305: U$1.B04 v37.47,45.72
  Bottom 0.305: ZED1.132 v43.25,51.44
L4$1_P  (via drill 0.3)  (1 unrouted)
  Top 0.305: U$1.A04 v37.47,46.99
  Bottom 0.305: ZED1.130 v42.45,51.44
L4$2_N  (via drill 0.3)  (1 unrouted)
  Top 0.305: U$1.AD11 v47.62,11.43
  Bottom 0.305: ZED1.63 v56.05,5.71
L4$2_P  (via drill 0.3)  (1 unrouted)
  Top 0.305: U$1.AE11 v47.62,10.16
  Bottom 0.305: ZED1.61 v55.25,5.71
L4$3_N  (via drill 0.3)  (1 unrouted)
  Top 0.305: U$1.B11 v47.62,45.72
  Bottom 0.305: ZED1.169 v58.45,50.16
L4$3_P  (via drill 0.3)  (1 unrouted)
  Top 0.305: U$1.A11 v47.62,46.99
  Bottom 0.305: ZED1.167 v57.65,50.16
L5$0_N  (via drill 0.3)  (1 unrouted)
  Top 0.305: U$1.AD05 v38.73,11.43
  Bottom 0.305: ZED1.31 v43.25,5.71
L5$0_P  (via drill 0.3)  (1 unrouted)
  Top 0.305: U$1.AE05 v38.73,10.16
  Bottom 0.305: ZED1.29 v42.45,5.71
L5$1_N  (via drill 0.3)  (1 unrouted)
  Top 0.305: U$1.B05 v38.73,45.72
  Bottom 0.305: ZED1.137 v45.65,50.16
L5$1_P  (via drill 0.3)  (1 unrouted)
  Top 0.305: U$1.A05 v38.73,46.99
  Bottom 0.305: ZED1.135 v44.85,50.16
L5$2_N  (via drill 0.3)  (1 unrouted)
  Top 0.305: U$1.AD12 v48.9,11.43
  Bottom 0.305: ZED1.64 v56.05,6.99
L5$2_P  (via drill 0.3)  (1 unrouted)
  Top 0.305: U$1.AE12 v48.9,10.16
  Bottom 0.305: ZED1.62 v55.25,6.99
L5$3_N  (via drill 0.3)  (1 unrouted)
  Top 0.305: U$1.B12 v48.9,45.72
  Bottom 0.305: ZED1.170 v58.45,51.44
L5$3_P  (via drill 0.3)  (1 unrouted)
  Top 0.305: U$1.A12 v48.9,46.99
  Bottom 0.305: ZED1.168 v57.65,51.44
L6$0_N  (via drill 0.3)  (1 unrouted)
  Top 0.305: U$1.AD06 v40.01,11.43
  Bottom 0.305: ZED1.32 v43.25,6.99
L6$0_P  (via drill 0.3)  (1 unrouted)
  Top 0.305: U$1.AE06 v40.01,10.16
  Bottom 0.305: ZED1.30 v42.45,6.99
L6$1_N  (via drill 0.3)  (1 unrouted)
  Top 0.305: U$1.B06 v40.01,45.72
  Bottom 0.305: ZED1.138 v45.65,51.44
L6$1_P  (via drill 0.3)  (1 unrouted)
  Top 0.305: U$1.A06 v40.01,46.99
  Bottom 0.305: ZED1.136 v44.85,51.44
L6$2_N  (via drill 0.3)  (1 unrouted)
  Top 0.305: U$1.AD13 v50.16,11.43
  Bottom 0.305: ZED1.69 v58.45,5.71
L6$2_P  (via drill 0.3)  (1 unrouted)
  Top 0.305: U$1.AE13 v50.16,10.16
  Bottom 0.305: ZED1.67 v57.65,5.71
L6$3_N  (via drill 0.3)  (1 unrouted)
  Top 0.305: U$1.B13 v50.16,45.72
  Bottom 0.305: ZED1.175 v60.85,50.16
L6$3_P  (via drill 0.3)  (1 unrouted)
  Top 0.305: U$1.A13 v50.16,46.99
  Bottom 0.305: ZED1.173 v60.05,50.16
MT  (7 unrouted)
N$1  (1 unrouted)
N$2  (1 unrouted)
N$3  (via drill 0.3)  (1 unrouted)
  Top 0.406: U$1.D09 v45.09,41.91
N$4  (1 unrouted)
N$9  (1 unrouted)
N$10  (3 unrouted)
N$11  (2 unrouted)
N$12  (4 unrouted)
N$13  (1 unrouted)
N$14  (2 unrouted)
N$15  (2 unrouted)
N$16  (1 unrouted)
N$17  (1 unrouted)
N$18  (1 unrouted)
N$19  (2 unrouted)
N$20  (1 unrouted)
N$21  (via drill 0.3)  (1 unrouted)
  Bottom 0.305: ZED1.187 v65.65,50.16
N$22  (via drill 0.3)  (1 unrouted)
  Bottom 0.305: ZED1.174 v60.05,51.44
N$23  (via drill 0.3)  (1 unrouted)
  Bottom 0.305: ZED1.124 v40.05,51.44
N$24  (via drill 0.3)  (1 unrouted)
  Bottom 0.305: ZED1.81 v63.25,5.71
N$25  (via drill 0.3)  (1 unrouted)
  Bottom 0.305: ZED1.68 v57.65,6.99
N$26  (via drill 0.3)  (1 unrouted)
  Bottom 0.305: ZED1.18 v37.65,6.99
N$27  (1 unrouted)
N$28  (2 unrouted)
N$29  (2 unrouted)
N$30  (1 unrouted)
N$31  (via drill 0.3)  (1 unrouted)
  Bottom 0.305: ZED1.47 v49.65,5.71
N$32  (1 unrouted)
N$33  (via drill 0.3)  (1 unrouted)
  Bottom 0.305: ZED1.48 v49.65,6.99
N$34  (via drill 0.3)  (1 unrouted)
  Bottom 0.305: ZED1.73 v60.05,5.71
N$35  (via drill 0.3)  (1 unrouted)
  Bottom 0.305: ZED1.74 v60.05,6.99
N$36  (via drill 0.3)  (1 unrouted)
  Bottom 0.305: ZED1.82 v63.25,6.99
N$37  (via drill 0.3)  (1 unrouted)
  Bottom 0.305: ZED1.153 v52.05,50.16
N$38  (via drill 0.3)  (1 unrouted)
  Bottom 0.305: ZED1.154 v52.05,51.44
N$39  (via drill 0.3)  (1 unrouted)
  Bottom 0.305: ZED1.181 v63.25,50.16
N$40  (via drill 0.3)  (1 unrouted)
  Bottom 0.305: ZED1.182 v63.25,51.44
N$41  (via drill 0.3)  (1 unrouted)
  Bottom 0.305: ZED1.188 v65.65,51.44
N$42  (1 unrouted)
N$43  (1 unrouted)
N$44  (1 unrouted)
N$45  (1 unrouted)
N$46  (1 unrouted)
N$47  (1 unrouted)
N$48  (1 unrouted)
N$49  (1 unrouted)
N$50  (1 unrouted)
N$51  (1 unrouted)
N$52  (1 unrouted)
N$53  (1 unrouted)
N$54  (1 unrouted)
N$55  (1 unrouted)
N$56  (1 unrouted)
N$57  (1 unrouted)
N$58  (1 unrouted)
N$59  (1 unrouted)
N$60  (1 unrouted)
N$61  (1 unrouted)
N$62  (1 unrouted)
N$63  (1 unrouted)
N$64  (1 unrouted)
N$65  (via drill 0.3)  (1 unrouted)
  Top 0.406: U$1.D07 v42.55,41.91
N$66  (via drill 0.3)  (1 unrouted)
  Top 0.406: U$1.D06 v41.27,41.91
N$67  (via drill 0.3)  (1 unrouted)
  Top 0.406: U$1.D05 v40.01,41.91
N$68  (via drill 0.3)  (1 unrouted)
  Bottom 0.305: ZED1.20 v38.45,6.99
N$69  (via drill 0.3)  (1 unrouted)
  Bottom 0.305: ZED1.49 v50.45,5.71
N$70  (via drill 0.3)  (1 unrouted)
  Bottom 0.305: ZED1.50 v50.45,6.99
N$71  (via drill 0.3)  (1 unrouted)
  Bottom 0.305: ZED1.70 v58.45,6.99
N$72  (via drill 0.3)  (1 unrouted)
  Bottom 0.305: ZED1.75 v60.85,5.71
N$73  (via drill 0.3)  (1 unrouted)
  Bottom 0.305: ZED1.76 v60.85,6.99
N$74  (via drill 0.3)  (1 unrouted)
  Bottom 0.305: ZED1.83 v64.05,5.71
N$75  (via drill 0.3)  (1 unrouted)
  Bottom 0.305: ZED1.84 v64.05,6.99
N$76  (via drill 0.3)  (1 unrouted)
  Bottom 0.305: ZED1.126 v40.85,51.44
N$77  (via drill 0.3)  (1 unrouted)
  Bottom 0.305: ZED1.155 v52.85,50.16
N$78  (via drill 0.3)  (1 unrouted)
  Bottom 0.305: ZED1.156 v52.85,51.44
N$79  (via drill 0.3)  (1 unrouted)
  Bottom 0.305: ZED1.176 v60.85,51.44
N$80  (via drill 0.3)  (1 unrouted)
  Bottom 0.305: ZED1.183 v64.05,50.16
N$81  (via drill 0.3)  (1 unrouted)
  Bottom 0.305: ZED1.184 v64.05,51.44
N$82  (via drill 0.3)  (1 unrouted)
  Bottom 0.305: ZED1.189 v66.45,50.16
N$83  (via drill 0.3)  (1 unrouted)
  Bottom 0.305: ZED1.190 v66.45,51.44
N$84  (1 unrouted)
N$85  (1 unrouted)
N$86  (1 unrouted)
N$87  (1 unrouted)
N$88  (1 unrouted)
N$89  (via drill 0.3)  (1 unrouted)
  Top 0.406: U$1.D08 v43.81,41.91
N$90  (1 unrouted)
N$91  (1 unrouted)
N$92  (1 unrouted)
N$93  (1 unrouted)
N$94  (1 unrouted)
N$95  (1 unrouted)
N$96  (1 unrouted)
N$97  (1 unrouted)
N$98  (1 unrouted)
N$99  (1 unrouted)
N$100  (1 unrouted)
N$101  (1 unrouted)
N$102  (1 unrouted)
N$103  (1 unrouted)
N$104  (1 unrouted)
N$105  (1 unrouted)
N$106  (1 unrouted)
N$107  (1 unrouted)
N$108  (1 unrouted)
N$109  (1 unrouted)
N$110  (1 unrouted)
N$111  (1 unrouted)
N$112  (1 unrouted)
N$113  (1 unrouted)
N$114  (1 unrouted)
N$115  (15 unrouted)
N$116  (7 unrouted)
SEL  (1 unrouted)
VCCO_34  (2 unrouted)
VCCO_35  (2 unrouted)
VDD_DIG  (1 unrouted)
  pour Top (isolate 0.254, rank 2, no thermals): 55.88,38.1 55.88,44.2 62.23,44.2 62.23,38.1
  pour Top (isolate 0.254, rank 2, no thermals): 55.88,12.95 55.88,19.05 62.36,19.05 62.36,12.95
VDD_LVDS  (3 unrouted)
  pour Top (isolate 0.254, no thermals): 62.48,38.1 62.48,44.2 63.88,44.2 63.88,38.1
  pour Top (isolate 0.254, no thermals): 62.48,12.95 62.48,19.05 63.88,19.05 63.88,12.95
  pour Top (no thermals): 37.72,38.1 37.72,44.2 39.37,44.2 39.37,38.1
  pour Top (no thermals): 37.72,12.95 37.72,19.05 39.37,19.05 39.37,12.95
VIN_HDR  (8 unrouted)
VREFP  (1 unrouted)
  pour Top (no thermals): 49.15,38.1 49.15,44.2 49.91,44.2 49.91,38.1
  pour Top (no thermals): 49.15,12.95 49.15,19.05 49.91,19.05 49.91,12.95
VSS_DIG  (via drill 0.3)  (15 unrouted)
  Top 0.406: v36.2,16.51 U$1.AA03 v36.2,15.24 U$1.AB03 v36.2,13.97 U$1.AC03 v36.2,12.7 | v36.2,44.45 U$1.C03 v36.2,43.18 U$1.D03 v36.2,41.91 U$1.E03 v36.2,40.64 | U$1.E19 v57.15,40.01 | v51.44,46.99 U$1.A14 v51.44,45.72 U$1.B14 v51.44,44.45 | U$1.E23 v62.23,40.01 | U$1.AA19 v57.15,17.14 | U$1.AA23 v62.23,17.14 | v51.44,12.7 U$1.AD14 v51.44,11.43 U$1.AE14 v51.44,10.16 | v41.27,13.97 U$1.AC06 v40.01,13.97 | v41.27,43.18 U$1.C06 v40.01,43.18 | v65.41,45.72 U$1.A26 v66.67,45.72 | v66.67,11.43 U$1.AE26 v65.41,11.43 | v65.41,44.45 U$1.C25 v65.41,43.18 U$1.D25 v65.41,41.91 U$1.E25 v65.41,40.64 | v65.41,16.51 U$1.AA25 v65.41,15.24 U$1.AB25 v65.41,13.97 U$1.AC25 v65.41,12.7
  pour Top (no thermals): 36.45,12.95 36.45,16.26 37.21,16.26 37.21,12.95
  pour Top (no thermals): 36.45,40.89 36.45,44.2 37.21,44.2 37.21,40.89
  pour Top (no thermals): 64.39,40.89 64.39,44.2 65.15,44.2 65.15,40.89
  pour Top (no thermals): 64.39,12.95 64.39,16.26 65.15,16.26 65.15,12.95